# EAGLE design Paulo V2 (EAGLE 7.6.0)
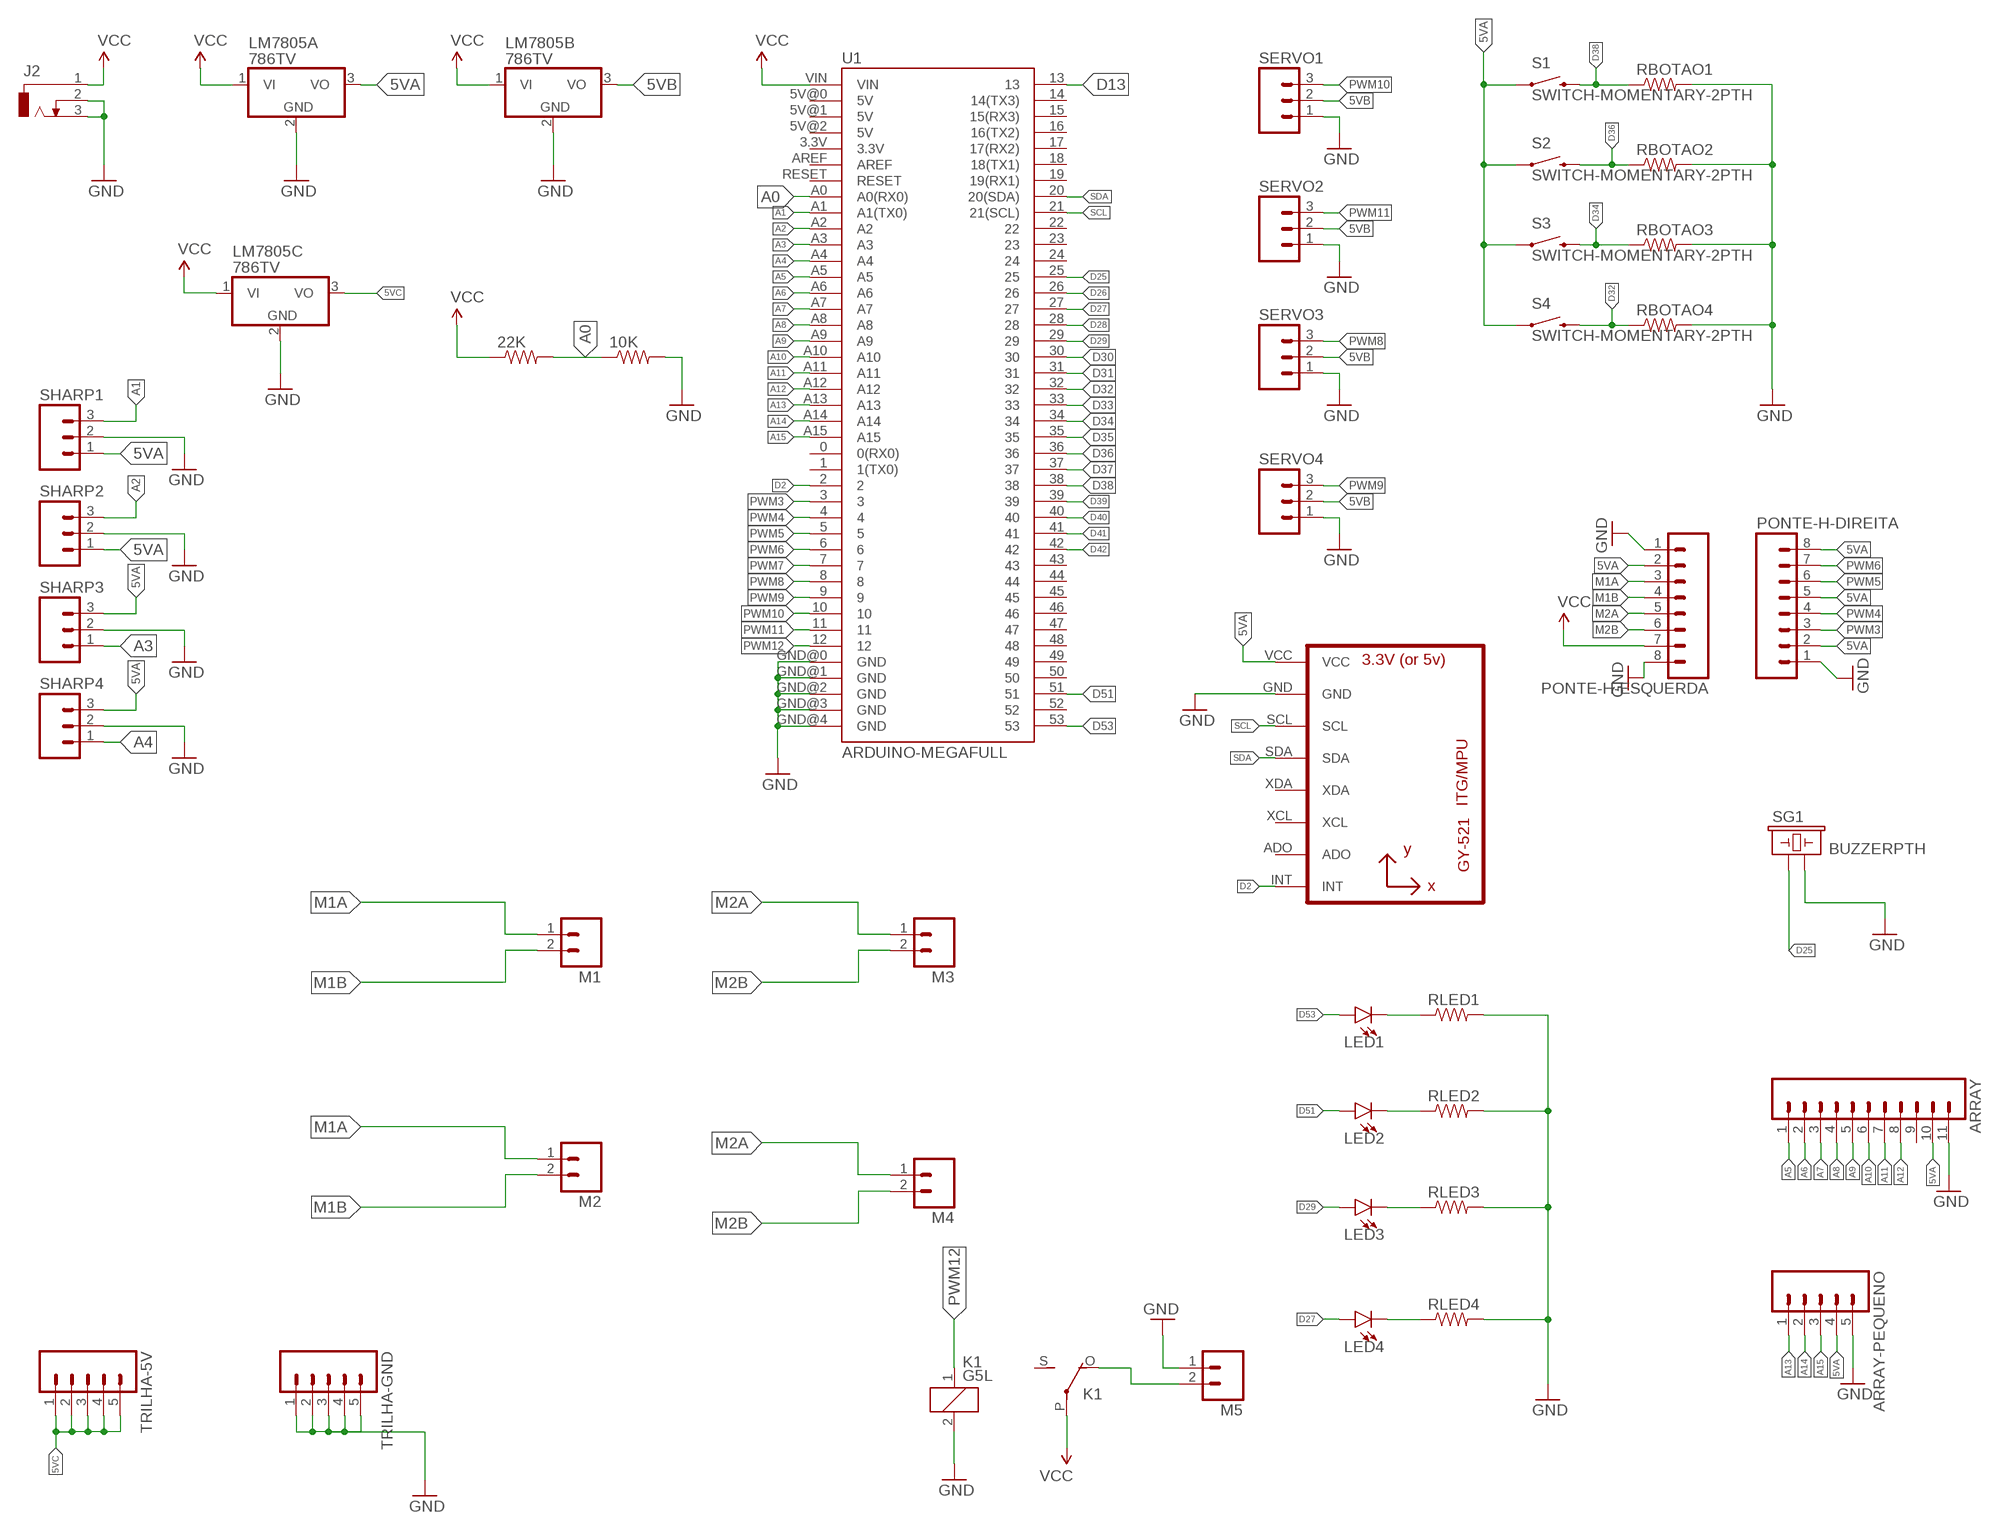
[diagram p0: schematic, sheet 1]

## Parts
10K  RESISTOREZ  [AXIAL-0.3EZ]
22K  RESISTOREZ  [AXIAL-0.3EZ]
ARRAY  M11POGOPIN_HOLES_ONLY  [1X11_HOLES_ONLY]
ARRAY-PEQUENO  M05PTH  [1X05]
J2  DCJ0303  [DCJ0303]
K1  G5L  [G5LE]
LED1  LED5MM  [LED_5MM]
LED2  LED5MM  [LED_5MM]
LED3  LED5MM  [LED_5MM]
LED4  LED5MM  [LED_5MM]
LM7805A  786TV  [TO220V]
LM7805B  786TV  [TO220V]
LM7805C  786TV  [TO220V]
M1  M02JST-PTH-VERT  [JST-2-PTH-VERT]
M2  M02JST-PTH-VERT  [JST-2-PTH-VERT]
M3  M02JST-PTH-VERT  [JST-2-PTH-VERT]
M4  M02JST-PTH-VERT  [JST-2-PTH-VERT]
M5  M02JST-PTH-VERT  [JST-2-PTH-VERT]
PONTE-H-DIREITA  M08NO_SILK  [1X08_PIN1_NO_SILK]
PONTE-H-ESQUERDA  M08NO_SILK  [1X08_PIN1_NO_SILK]
RBOTAO1  RESISTOREZ  [AXIAL-0.3EZ]
RBOTAO2  RESISTOREZ  [AXIAL-0.3EZ]
RBOTAO3  RESISTOREZ  [AXIAL-0.3EZ]
RBOTAO4  RESISTOREZ  [AXIAL-0.3EZ]
RLED1  RESISTOREZ  [AXIAL-0.3EZ]
RLED2  RESISTOREZ  [AXIAL-0.3EZ]
RLED3  RESISTOREZ  [AXIAL-0.3EZ]
RLED4  RESISTOREZ  [AXIAL-0.3EZ]
S1  SWITCH-MOMENTARY-2PTH  [TACTILE-PTH]
S2  SWITCH-MOMENTARY-2PTH  [TACTILE-PTH]
S3  SWITCH-MOMENTARY-2PTH  [TACTILE-PTH]
S4  SWITCH-MOMENTARY-2PTH  [TACTILE-PTH]
SERVO1  M03LONGPADS  [1X03_LONGPADS@1]
SERVO2  M03LONGPADS  [1X03_LONGPADS@1]
SERVO3  M03LONGPADS  [1X03_LONGPADS@1]
SERVO4  M03LONGPADS  [1X03_LONGPADS@1]
SG1  BUZZERPTH  [BUZZER-12MM]
SHARP1  M03LONGPADS  [1X03_LONGPADS@1]
SHARP2  M03LONGPADS  [1X03_LONGPADS@1]
SHARP3  M03LONGPADS  [1X03_LONGPADS@1]
SHARP4  M03LONGPADS  [1X03_LONGPADS@1]
TRILHA-5V  M05PTH  [1X05]
TRILHA-GND  M05PTH  [1X05]
U1  ARDUINO-MEGAFULL  [ARDUINO_MEGA]
U2  GY-521MPU6050  [GY-521]

## Nets
5VA: ARRAY-PEQUENO.4 ARRAY.10 LM7805A.3(VO) PONTE-H-DIREITA.2 PONTE-H-DIREITA.5 PONTE-H-DIREITA.8 PONTE-H-ESQUERDA.2 S1.1 S2.1 S3.1 S4.1 SHARP1.1 SHARP2.1 SHARP3.3 SHARP4.3 U2.VCC
5VB: LM7805B.3(VO) SERVO1.2 SERVO2.2 SERVO3.2 SERVO4.2
5VC: LM7805C.3(VO) TRILHA-5V.1 TRILHA-5V.2 TRILHA-5V.3 TRILHA-5V.4 TRILHA-5V.5
A0: 10K.P$1 22K.P$2 U1.A0(A0(RX0))
A1: SHARP1.3 U1.A1(A1(TX0))
A2: SHARP2.3 U1.A2
A3: SHARP3.1 U1.A3
A4: SHARP4.1 U1.A4
A5: ARRAY.1 U1.A5
A6: ARRAY.2 U1.A6
A7: ARRAY.3 U1.A7
A8: ARRAY.4 U1.A8
A9: ARRAY.5 U1.A9
A10: ARRAY.6 U1.A10
A11: ARRAY.7 U1.A11
A12: ARRAY.8 U1.A12
A13: ARRAY-PEQUENO.1 U1.A13
A14: ARRAY-PEQUENO.2 U1.A14
A15: ARRAY-PEQUENO.3 U1.A15
D2: U1.2 U2.INT
D13: U1.13
D25: SG1.+ U1.25
D26: U1.26
D27: LED4.A U1.27
D28: U1.28
D29: LED3.A U1.29
D30: U1.30
D31: U1.31
D32: RBOTAO4.P$1 S4.3 U1.32
D33: U1.33
D34: RBOTAO3.P$1 S3.3 U1.34
D35: U1.35
D36: RBOTAO2.P$1 S2.3 U1.36
D37: U1.37
D38: RBOTAO1.P$1 S1.3 U1.38
D39: U1.39
D40: U1.40
D41: U1.41
D42: U1.42
D51: LED2.A U1.51
D53: LED1.A U1.53
GND: 10K.P$2 ARRAY-PEQUENO.5 ARRAY.11 J2.2 J2.3 K1.2 LM7805A.2(GND) LM7805B.2(GND) LM7805C.2(GND) M5.1 PONTE-H-DIREITA.1 PONTE-H-ESQUERDA.1 PONTE-H-ESQUERDA.8 RBOTAO1.P$2 RBOTAO2.P$2 RBOTAO3.P$2 RBOTAO4.P$2 RLED1.P$2 RLED2.P$2 RLED3.P$2 RLED4.P$2 SERVO1.1 SERVO2.1 SERVO3.1 SERVO4.1 SG1.- SHARP1.2 SHARP2.2 SHARP3.2 SHARP4.2 TRILHA-GND.1 TRILHA-GND.2 TRILHA-GND.3 TRILHA-GND.4 TRILHA-GND.5 U1.GND@0(GND) U1.GND@1(GND) U1.GND@2(GND) U1.GND@3(GND) U1.GND@4(GND) U2.GND
M1A: M1.1 M2.1 PONTE-H-ESQUERDA.3
M1B: M1.2 M2.2 PONTE-H-ESQUERDA.4
M2A: M3.1 M4.1 PONTE-H-ESQUERDA.5
M2B: M3.2 M4.2 PONTE-H-ESQUERDA.6
N$1: LED1.K(C) RLED1.P$1
N$2: LED2.K(C) RLED2.P$1
N$3: LED3.K(C) RLED3.P$1
N$4: LED4.K(C) RLED4.P$1
N$41: K1.O(2:O) M5.2
PWM3: PONTE-H-DIREITA.3 U1.3
PWM4: PONTE-H-DIREITA.4 U1.4
PWM5: PONTE-H-DIREITA.6 U1.5
PWM6: PONTE-H-DIREITA.7 U1.6
PWM7: U1.7
PWM8: SERVO3.3 U1.8
PWM9: SERVO4.3 U1.9
PWM10: SERVO1.3 U1.10
PWM11: SERVO2.3 U1.11
PWM12: K1.1 U1.12
SCL: U1.21(21(SCL)) U2.SCL
SDA: U1.20(20(SDA)) U2.SDA
VCC: 22K.P$1 J2.1 K1.P(2:P) LM7805A.1(VI) LM7805B.1(VI) LM7805C.1(VI) PONTE-H-ESQUERDA.7 U1.VIN
Unconnected: ARRAY.9 K1.S(2:S) U1.0(0(RX0)) U1.1(1(TX0)) U1.3.3V U1.5V@0(5V) U1.5V@1(5V) U1.5V@2(5V) U1.14(14(TX3)) U1.15(15(RX3)) U1.16(16(TX2)) U1.17(17(RX2)) U1.18(18(TX1)) U1.19(19(RX1)) U1.22 U1.23 U1.24 U1.43 U1.44 U1.45 U1.46 U1.47 U1.48 U1.49 U1.50 U1.52 U1.AREF U1.RESET U2.ADO U2.XCL U2.XDA

## Library data of the parts
10K 22K RBOTAO1-RBOTAO4 RLED1-RLED4 = SparkFun-Passives:RESISTOR: Resistor Basic schematic elements and footprints for 0603, 1206, and PTH resistors.
ARRAY = SparkFun-Connectors:M11: Header 11 Standard 11-pin 0.1" header. Use with straight break away headers (SKU : PRT-00116), right angle break away headers (PRT-00553), swiss pins (PRT-00743), machine pins (PRT-00117), and female headers (PRT-00115).
ARRAY-PEQUENO TRILHA-5V TRILHA-GND = SparkFun-Connectors:M05: Header 5 Standard 5-pin 0.1" header. Use with straight break away headers (SKU : PRT-00116), right angle break away headers (PRT-00553), swiss pins (PRT-00743), machine pins (PRT-00117), and female headers (PRT-00115). Molex polarized connector foot print use with SKU : PRT-08230 with associated crimp pins and housings.
J2 = con-jack:DCJ0303: DC POWER JACK Source: DCJ0303.pdf; OC_FARNELL: unknown; OC_NEWARK: unknown
K1 = relay:G5L: RELAY 1 x switch, 10 A/120 V AC, 8 A/30 V ADC, Omron
LED1-LED4 = SparkFun-LED:LED: LED (Generic) Standard schematic elements and footprints for 5mm, 3mm, 1206, and 0603 sized LEDs. Generic LEDs with no color specified.
LM7805A LM7805B LM7805C = linear:78*: Positive VOLTAGE REGULATOR Source: http://cache.national.com/ds/LM/LM78L05.pdf http://www.fairchildsemi.com/ds/LM/LM7805.pdf
M1-M5 = SparkFun-Connectors:M02: Standard 2-pin 0.1" header. Use with - straight break away headers ( PRT-00116) - right angle break away headers (PRT-00553) - swiss pins (PRT-00743) - machine pins (PRT-00117) - female headers (PRT-00115) Molex polarized connector foot print use with: PRT-08233 with associated crimp pins and housings. 2.54_SCREWTERM for use with PRT-10571. 3.5mm Screw Terminal footprints for PRT-08084 5mm Screw Terminal footprints for use with PRT-08432
PONTE-H-DIREITA PONTE-H-ESQUERDA = SparkFun-Connectors:M08: Header 8 Standard 8-pin 0.1" header. Use with straight break away headers (SKU : PRT-00116), right angle break away headers (PRT-00553), swiss pins (PRT-00743), machine pins (PRT-00117), and female headers (PRT-00115).
S1-S4 = SparkFun-Electromechanical:SWITCH-MOMENTARY-2: Various NO switches- pushbuttons, reed, etc; PROD_ID: SWCH-08441
SERVO1-SERVO4 SHARP1-SHARP4 = SparkFun-Connectors:M03: Header 3 Standard 3-pin 0.1" header. Use with straight break away headers (SKU : PRT-00116), right angle break away headers (PRT-00553), swiss pins (PRT-00743), machine pins (PRT-00117), and female headers (PRT-00115). Molex polarized connector foot print use with SKU : PRT-08232 with associated crimp pins and housings.
SG1 = SparkFun-Electromechanical:BUZZER: Buzzer 12mm Spark Fun Electronics SKU : Comp-Buzzer
U1 = SparkFun-Boards:ARDUINO-MEGA: Arduino Mega board footprint
U2 = gy-521:GY-521

## Board
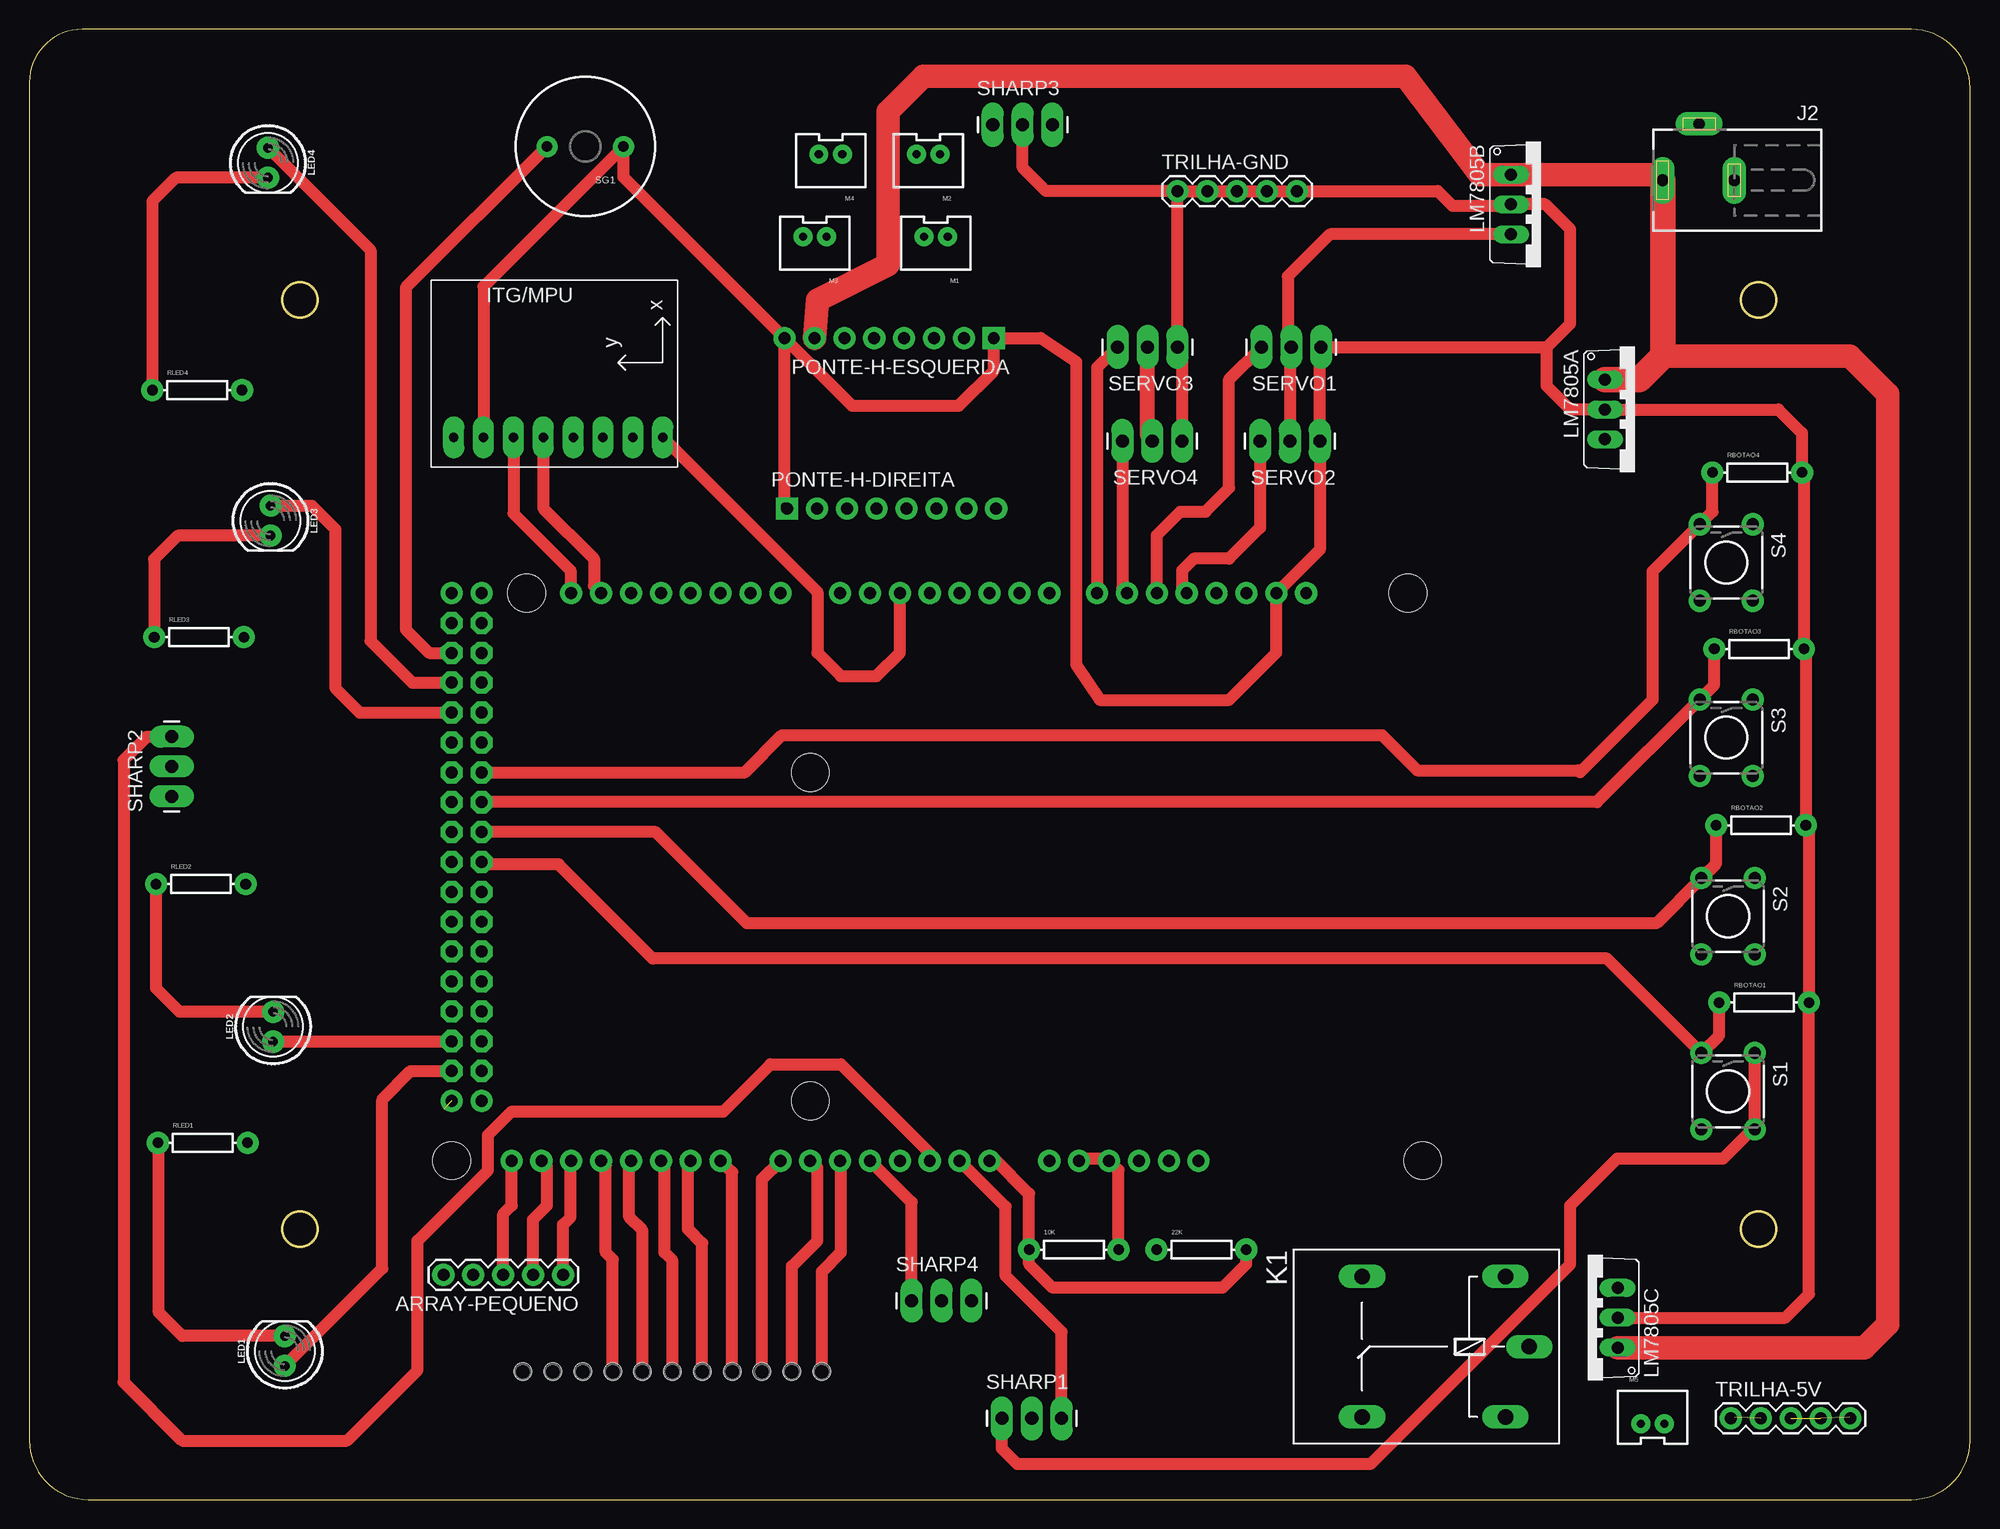
[diagram p1: board, top side]
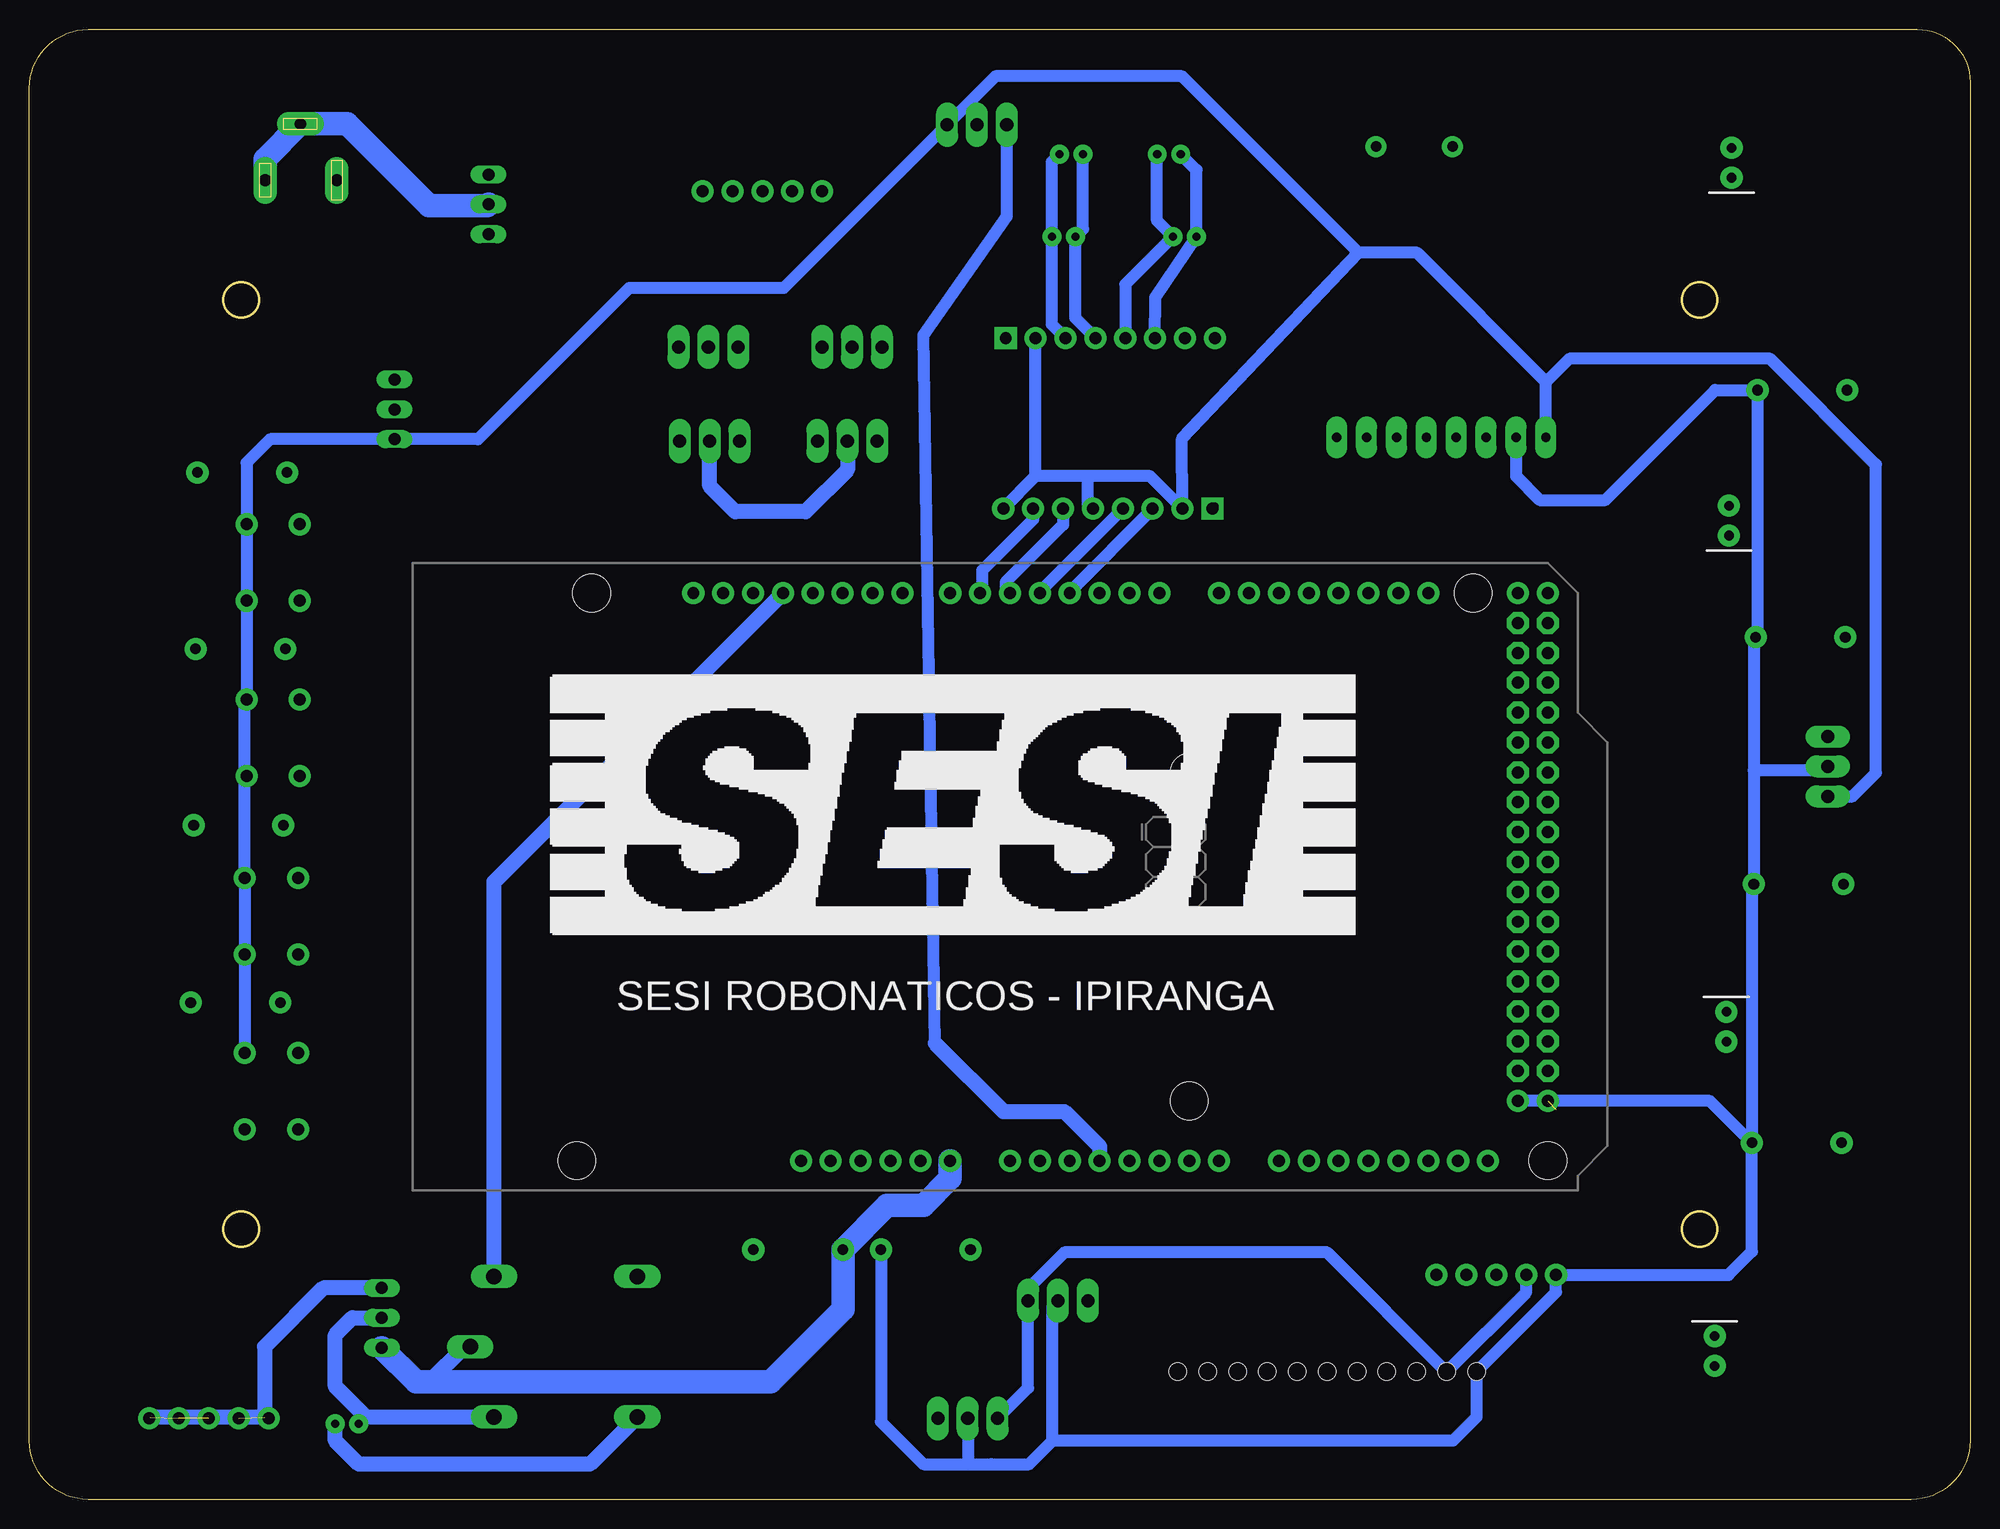
[diagram p2: board, bottom side, seen from below]

Size 165 x 125 mm. Coordinates in mm from the lower left corner, seen from the top.
Outline: 165,5 165,120 arc90 160,125 4.47,125 arc90 0,120.53 0,5 arc90 5,0 160,0 arc90 165,5
Outline: circle at 23,102 radius 1.5
Outline: circle at 23,23 radius 1.5
Outline: circle at 147,102 radius 1.5
Outline: circle at 147,23 radius 1.5
Copper layers (1*16): Top 0.035mm / dielectric 1.5mm / Bottom 0.035mm
Design rules "default": minimum track width 10mil, minimum drill 24mil, track to track 8mil, track to pad 8mil, pad to pad 8mil, via to via 8mil, smd to smd 8mil, copper to edge 40mil, drill to drill 8mil, minimum pad ring 10mil, minimum via ring 8mil, stop-mask expansion 4mil, vias tented up to drill 0mil, thermal gap 10mil

### Footprints (pad centres in the part's own frame; a part is rotated, then mirrored left to right if it is on the bottom)
AXIAL-0.3EZ = drill 0.9 pad 1.88: P$1 -3.81,0; P$2 3.81,0
1X11_HOLES_ONLY = drill 0.889 pad 0.813: 1 0,0; 2 2.54,0; 3 5.08,0; 4 7.62,0; 5 10.16,0; 6 12.7,0; 7 15.24,0; 8 17.78,0; 9 20.32,0; 10 22.86,0; 11 25.4,0 | hole 1.473: 0,0; 2.54,0; 5.08,0; 7.62,0; 10.16,0; 12.7,0; 15.24,0; 17.78,0; 20.32,0; 22.86,0; 25.4,0
1X05 = drill 1.016 pad 1.88: 1 0,0; 2 2.54,0; 3 5.08,0; 4 7.62,0; 5 10.16,0
DCJ0303 = drill 1 pad 2 long: 1 0,3.1; 2 4.8,0; 3 0,-3
G5LE = drill 1.321 long: 1 -7.493,-5.969; 2 -7.493,5.969; O 4.699,5.969; P -9.525,0; S 4.699,-5.969
LED_5MM = drill 0.813 pad 1.88: A -1.27,0; K 1.27,0
TO220V = drill 1.016 long: 1 -2.54,-2.54; 2 0,-2.54; 3 2.54,-2.54
JST-2-PTH-VERT = drill 0.7 pad 1.6: 1 -1,-0.55; 2 1,-0.55
1X08_PIN1_NO_SILK = drill 1.016 pad 1.88 square: 1 0,0 | drill 1.016 pad 1.88: 2 2.54,0; 3 5.08,0; 4 7.62,0; 5 10.16,0; 6 12.7,0; 7 15.24,0; 8 17.78,0
TACTILE-PTH = drill 1.016 pad 1.88: 1 -3.251,2.261; 2 3.251,2.261; 3 -3.251,-2.261; 4 3.251,-2.261
1X03_LONGPADS@1 = drill 1.118 pad 1.88 long: 1 0,0; 2 2.54,0; 3 5.08,0
BUZZER-12MM = drill 0.9 pad 1.778: + 3.25,0; - -3.25,0
ARDUINO_MEGA = drill 1.016 pad 1.88: 0 63.5,50.8; 1 60.96,50.8; 2 58.42,50.8; 3 55.88,50.8; 3.3V 35.56,2.54; 4 53.34,50.8; 5 50.8,50.8; 5V@0 38.1,2.54; 5V@1 93.98,50.8; 5V@2 96.52,50.8; 6 48.26,50.8; 7 45.72,50.8; 8 41.656,50.8; 9 39.116,50.8; 10 36.576,50.8; 11 34.036,50.8; 12 31.496,50.8; 13 28.956,50.8; 14 68.58,50.8; 15 71.12,50.8; 16 73.66,50.8; 17 76.2,50.8; 18 78.74,50.8; 19 81.28,50.8; 20 83.82,50.8; 21 86.36,50.8; A0 50.8,2.54; A1 53.34,2.54; A2 55.88,2.54; A3 58.42,2.54; A4 60.96,2.54; A5 63.5,2.54; A6 66.04,2.54; A7 68.58,2.54; A8 73.66,2.54; A9 76.2,2.54; A10 78.74,2.54; A11 81.28,2.54; A12 83.82,2.54; A13 86.36,2.54; A14 88.9,2.54; A15 91.44,2.54; AREF 23.876,50.8; GND@0 40.64,2.54; GND@1 43.18,2.54; GND@2 93.98,7.62; GND@3 96.52,7.62; GND@4 26.416,50.8; RESET 33.02,2.54; VIN 45.72,2.54 | drill 1.016 pad 1.88 octagon: 22 93.98,48.26; 23 96.52,48.26; 24 93.98,45.72; 25 96.52,45.72; 26 93.98,43.18; 27 96.52,43.18; 28 93.98,40.64; 29 96.52,40.64; 30 93.98,38.1; 31 96.52,38.1; 32 93.98,35.56; 33 96.52,35.56; 34 93.98,33.02; 35 96.52,33.02; 36 93.98,30.48; 37 96.52,30.48; 38 93.98,27.94; 39 96.52,27.94; 40 93.98,25.4; 41 96.52,25.4; 42 93.98,22.86; 43 96.52,22.86; 44 93.98,20.32; 45 96.52,20.32; 46 93.98,17.78; 47 96.52,17.78; 48 93.98,15.24; 49 96.52,15.24; 50 93.98,12.7; 51 96.52,12.7; 52 93.98,10.16; 53 96.52,10.16 | hole 3.2: 15.24,50.8; 13.97,2.54; 66.04,35.56; 66.04,7.62; 90.17,50.8; 96.52,2.54
GY-521 = drill 0.8 pad 1.778 long: ADO -8.89,-6.35; GND -8.89,6.35; INT -8.89,-8.89; SCL -8.89,3.81; SDA -8.89,1.27; VCC -8.89,8.89; XCL -8.89,-3.81; XDA -8.89,-1.27

### Placement (x,y rotation side)
10K  88.8,21.25 0 top
22K  99.64,21.25 0 top
ARRAY  67.37,10.86 180 top
ARRAY-PEQUENO  45.36,19.1 180 top
J2  141.96,112.17 90 top
K1  118,13 180 top
LED1  21.72,12.63 90 top
LED2  20.72,40.2 90 top
LED3  20.5,83.23 270 top
LED4  20.28,113.66 270 top
LM7805A  136.5,92.69 270 top
LM7805B  128.5,110.12 270 top
LM7805C  132.5,15.45 90 top
M1  77.07,106.83 180 top
M2  76.42,113.83 180 top
M3  66.77,106.83 180 top
M4  68.12,113.83 180 top
M5  138,7 0 top
PONTE-H-DIREITA  64.42,84.25 0 top
PONTE-H-ESQUERDA  81.99,98.75 180 top
RBOTAO1  147.48,42.25 0 top
RBOTAO2  147.22,57.33 0 top
RBOTAO3  147.06,72.33 0 top
RBOTAO4  146.9,87.33 0 top
RLED1  14.74,30.33 0 top
RLED2  14.58,52.33 0 top
RLED3  14.42,73.33 0 top
RLED4  14.26,94.33 0 top
S1  144.42,34.71 270 top
S2  144.42,49.6 270 top
S3  144.28,64.78 270 top
S4  144.28,79.67 270 top
SERVO1  109.82,97.99 180 top
SERVO2  109.71,89.99 180 top
SERVO3  97.6,97.99 180 top
SERVO4  98,90 180 top
SG1  47.26,115.04 180 top
SHARP1  82.68,6.9 0 top
SHARP2  12.1,59.79 90 top
SHARP3  81.9,116.9 0 top
SHARP4  75.01,16.9 0 top
TRILHA-5V  144.67,6.9 0 top
TRILHA-GND  97.6,111.25 0 top
U1  132.43,26.27 0 bottom
U2  44.96,99.22 90 top

### Tracks (layer width: path | path; a pad name or v marks a point on that pad's centre or on a via)
5VA
  Top 1: S1.1 146.68,31.68 144,29 135,29 131,25 131,20 114,3 84,3 82.68,4.32 SHARP1.1
  Bottom 1: ARRAY-PEQUENO.4 37.74,17.63 ARRAY.10 54.65,21 77,21 80.09,17.91 SHARP4.3 80.09,9.49 SHARP1.1 | U2.VCC 36.07,95 | 36.07,95 36.07,95.07 47,106 52,106 | 52,106 67,121 82.88,121 SHARP3.3 100.88,103 114,103 126.85,90.15 LM7805A.3 144.54,90.15 146.54,88.15 S4.1 S3.1 146.68,67.89 S2.1 S1.1 | SHARP2.1 10,59.79 8,61.79 8,88 17,97 34.07,97 36.07,95 | 52,106 67,90.21 PONTE-H-DIREITA.2 69.71,87 75,87 | PONTE-H-DIREITA.8 79.45,87 | 79.45,87 PONTE-H-ESQUERDA.2 | 75,87 79.45,87 | PONTE-H-DIREITA.5 75,84.67 75,87
5VB
  Top 1: LM7805B.3 110.58,107.58 107,104 107,98.27 SERVO1.2 107.17,97.99 SERVO2.2
  Top 1.27: SERVO4.2 95.06,90.4 SERVO3.2
  Bottom 1.27: SERVO4.2 95.46,87.54 99,84 105,84 107.17,86.17 SERVO2.2
5VC  (3 unrouted)
  Bottom 1.27: LM7805C.3 140.01,17.99 145,13 145,7 | 145,7 144.77,7 TRILHA-5V.1 | 145,7 154.73,7 TRILHA-5V.5
A0
  Top 1: U1.A0 81.81,28.81 82,29 84.99,26.01 10K.P$1 84.99,20 86.99,18 101.45,18 103.45,20 22K.P$2
A1
  Top 1: U1.A1 83,24.9 83,19 87.76,14.24 SHARP1.3
A2
  Top 1: U1.A2 76.55,29.45 69,37 63,37 59,33 41,33 39,31 39,28 33,22 33,11 27,5 13,5 8,10 8,62.87 10,64.87 SHARP2.3
A3
  Bottom 1: 88,38.8 89,99 81.9,109.1 SHARP3.1
  Bottom 1.27: 88,38.8 82.2,33 77,33 74.01,30.01 U1.A3
A4
  Top 1: SHARP4.1 75.01,25.27 U1.A4
A5
  Top 1: ARRAY.1 67.37,19.37 69,21 69,28.74 U1.A5
A6
  Top 1: ARRAY.2 64.83,19.83 67,22 67,28.2 U1.A6
A7
  Top 1: ARRAY.3 62.29,27.25 U1.A7
A8
  Top 1: ARRAY.4 59.75,27.83 U1.A8
A9
  Top 1: ARRAY.5 57.21,21.79 56,23 56,28.58 U1.A9
A10
  Top 1: ARRAY.6 54.67,20.33 54,21 54,28.5 U1.A10
A11
  Top 1: ARRAY.7 52.13,22.87 51,24 51,28.66 U1.A11
A12
  Top 1: ARRAY.8 49.59,20.41 49,21 49,28.42 U1.A12
A13
  Top 1: ARRAY-PEQUENO.1 45.36,23.36 46,24 46,28.74 U1.A13
A14
  Top 1: ARRAY-PEQUENO.2 42.82,23.82 44,25 44,28.34 U1.A14
A15
  Top 1: ARRAY-PEQUENO.3 40.28,24.28 41,25 U1.A15
D2
  Top 1: U2.INT 67,77.18 67,72 69,70 72,70 74.01,72.01 U1.2
D25
  Top 1: SG1.+ 32,103.03 32,73.99 34,71.99 U1.25
D27
  Top 1: LED4.A 29,106.21 29,73 32.55,69.45 U1.27
D29
  Top 1: LED3.A 24,84.5 26,82.5 26,69 28.09,66.91 U1.29
D32
  Top 1: RBOTAO4.P$1 143.09,83.99 S4.3 138,78.9 138,68 131.83,61.83 131.66,62 118,62 115,65 64,65 60.83,61.83 U1.32
D34
  Top 1: RBOTAO3.P$1 143.25,69.26 S3.3 133.28,59.29 U1.34
D36
  Top 1: RBOTAO2.P$1 143.41,54.1 S2.3 138.31,49 61,49 53.25,56.75 U1.36
D38
  Top 1: RBOTAO1.P$1 143.67,39.47 S1.3 134.12,46 53,46 45,54 38,54 38.21,54.21 U1.38
D51
  Top 1: LED2.A 20.76,38.97 U1.51
D53
  Top 1: LED1.A 30,19.64 30,34 32.43,36.43 U1.53
GND  (via drill 0.6)  (1 unrouted)
  Top 1: U1.GND@1 89.19,28.81 89,29 91.6,29 U1.GND@0 92.61,27.99 10K.P$2 | TRILHA-GND.1 TRILHA-GND.2 TRILHA-GND.3 TRILHA-GND.4 | TRILHA-GND.4 TRILHA-GND.5 119.75,111.25 121,110 125.84,110 LM7805B.2 128.88,110.12 131,108 131,99.99 129,97.99 | SERVO4.1 98,97.59 SERVO3.1 TRILHA-GND.1 | 129,97.99 SERVO1.1 109.71,97.88 SERVO2.1 109.71,80.77 U1.GND@4 106.01,72.01 102,68 91,68 89,71 89,96.75 86,98.75 PONTE-H-ESQUERDA.1 81.99,95.99 79,93 69.96,93 PONTE-H-ESQUERDA.8 | TRILHA-GND.1 86.44,111.25 84.44,113.25 SHARP3.2 | LM7805C.2 149.29,15.45 151.29,17.45 RBOTAO1.P$2 151.29,57.07 RBOTAO2.P$2 151.03,72.17 RBOTAO3.P$2 150.87,87.17 RBOTAO4.P$2 150.71,90.69 148.71,92.69 LM7805A.2 131,92.69 129,94.69 129,97.99 | U2.GND 38.61,103.14 SG1.- 50.51,112.45 PONTE-H-ESQUERDA.8 | TRILHA-GND.4 TRILHA-GND.5 108,111 | v64.21,84.46 PONTE-H-ESQUERDA.8
  Bottom 1: SHARP1.2 85.22,2.97 83.22,3 | 83.22,3 80,3 78,5 | 78,5 78,16.45 SHARP4.2 | 78,5 43.97,5 41.97,7 ARRAY.11 35.2,17.63 ARRAY-PEQUENO.5 20.55,19.1 18.55,21.1 RLED1.P$2 | RLED1.P$2 22.11,33.89 U1.GND@3 U1.GND@2 | RLED1.P$2 18.55,52.17 RLED2.P$2 18.39,62 | 18.39,62 18.39,73.17 RLED3.P$2 18.07,73.49 RLED4.P$2 21.67,94.33 31,85 36.61,85 38.61,87 U2.GND | SHARP2.2 12.43,62 18.39,62 | 83.22,3 89,3 92.61,6.61 10K.P$2 | PONTE-H-DIREITA.1 v64.21,84.46
  Bottom 1.27: M5.1 136.42,7.03 | 136.42,7.03 K1.2 | 136.42,7.03 139,9.61 139,14 137.55,15.45 LM7805C.2
  Bottom 2: LM7805B.2 126.08,110 131,110 137.97,116.97 J2.2 144.96,113.97 J2.3
M1A
  Bottom 1: PONTE-H-ESQUERDA.3 78.07,99.91 M1.1 78.07,113.73 M2.1
M1B
  Bottom 1: PONTE-H-ESQUERDA.4 76.07,100.45 M1.2 75.42,108.03 M2.2
M2A
  Bottom 1: PONTE-H-ESQUERDA.5 71.83,103.32 M3.1 69.12,108.73 M4.1
M2B
  Bottom 1: PONTE-H-ESQUERDA.6 69.27,102.23 M3.2 65.77,113.03 M4.2
N$1
  Top 1: LED1.K 13,13.9 11,15.9 11,30.26 RLED1.P$1
N$2
  Top 1: LED2.K 12.77,41.47 10.77,43.47 RLED2.P$1
N$3
  Top 1: LED3.K 12.61,81.96 10.61,79.96 RLED3.P$1
N$4
  Top 1: LED4.K 12.45,112.39 10.45,110.39 RLED4.P$1
N$41
  Bottom 1.27: K1.O 117.33,3 137,3 139,5 M5.2
PWM3
  Bottom 1: PONTE-H-DIREITA.3 76.55,77.2 U1.3
PWM4
  Bottom 1: PONTE-H-DIREITA.4 79.09,77.2 U1.4
PWM5
  Bottom 1: PONTE-H-DIREITA.6 77.12,82.88 82,78 82,77.44 U1.5
PWM6
  Bottom 1: PONTE-H-DIREITA.7 79.66,83.34 84,79 84,77.24 U1.6
PWM8
  Top 1: SERVO3.3 90.77,96.24 U1.8
PWM9
  Top 1: SERVO4.3 92.92,77.46 U1.9
PWM10
  Top 1: U1.10 95.85,82 97.85,84 100,84 102,86 102,95.25 SERVO1.3
PWM11
  Top 1: SERVO2.3 104.63,82.63 102,80 99,80 98,79 98,77.46 U1.11
PWM12
  Bottom 1.27: K1.1 125.49,52.51 U1.12
SCL
  Top 1: U2.SCL 41.15,83.85 46,79 46,77.14 U1.21
SDA
  Top 1: U2.SDA 43.69,84.31 48,80 48,77.68 U1.20
VCC
  Top 2: J2.1 138.37,112.66 LM7805B.1 123.34,112.66 117,121 76,121 73,118 73,105 67,102 PONTE-H-ESQUERDA.7 | LM7805C.1 156,12.91 158,14.91 158,94 154.77,97.23 138.86,97.23
  Top 2.184: J2.1 138.86,97.23 136.86,95.23 LM7805A.1
  Bottom 1.27: K1.P 128,13 131,10
  Bottom 2: LM7805C.1 132.13,10 131,10 102,10 95.83,16.17 22K.P$1 92.08,25 89,25 86.71,27.29 U1.VIN

### Text on the board
bPlace: SESI ROBONATICOS - IPIRANGA